# EAGLE design Nixie74141 (EAGLE 5.10)
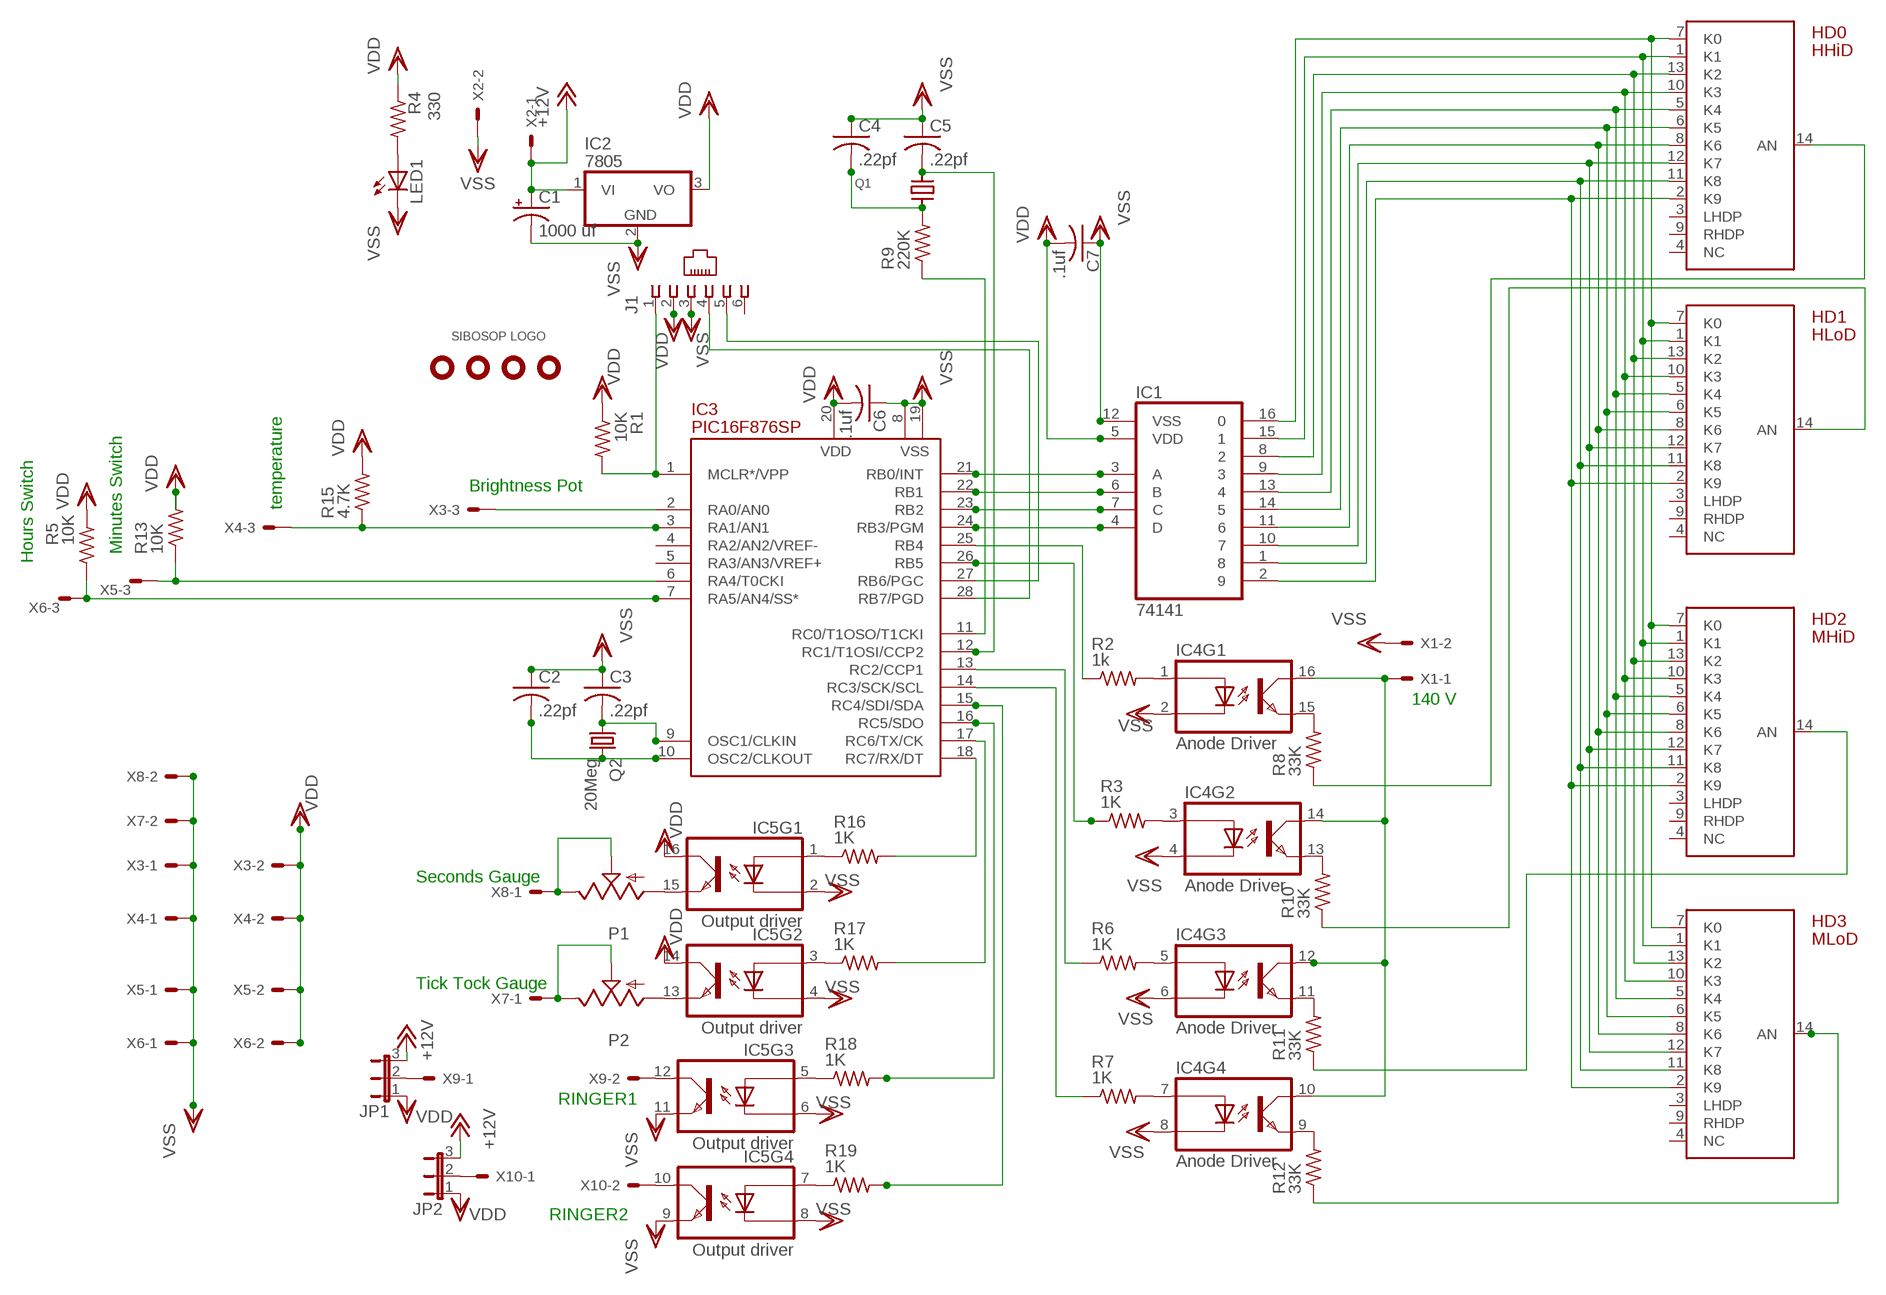
[diagram p0: schematic, sheet 1]

## Parts
C1  1000 uf  CPOL-USE3.5-10  [E3,5-10]
C2  .22pf  C-US025-024X044  [C025-024X044]
C3  .22pf  C-US025-024X044  [C025-024X044]
C4  .22pf  C-US025-024X044  [C025-024X044]
C5  .22pf  C-US025-024X044  [C025-024X044]
C6  .1uf  C-US025-024X044  [C025-024X044]
C7  .1uf  C-US025-024X044  [C025-024X044]
HD0  HHiD  NIXIE-5440-HEADER  [DIL14]
HD1  HLoD  NIXIE-5440-HEADER  [DIL14]
HD2  MHiD  NIXIE-5440-HEADER  [DIL14]
HD3  MLoD  NIXIE-5440-HEADER  [DIL14]
IC1  74141  [DIP16]
IC2  7805  [TO220V]
IC3  PIC16F876SP  [DIL28-3]
IC4  Anode Driver  TLP627  [DIP16]
IC5  Output driver  TLP627  [DIP16]
J1  520250-3  [520250-3]
JP1  JP2E  [JP2]
JP2  JP2E  [JP2]
LED1  LEDSQR2X5  [LED2X5]
P1  TRIMPOT  [RJ6S]
P2  TRIMPOT  [RJ6S]
Q1  ECS-2X6  [RADIAL-CRYSTAL-2.1MM]
Q2  20Meg  CRYSTALHC49S  [HC49/S]
R1  10K  R-US_0204/2V  [0204V]
R2  1k  R-US_0204/2V  [0204V]
R3  1K  R-US_0204/2V  [0204V]
R4  330  R-US_0204/2V  [0204V]
R5  10K  R-US_0204/2V  [0204V]
R6  1K  R-US_0204/2V  [0204V]
R7  1K  R-US_0204/2V  [0204V]
R8  33K  R-US_0204/2V  [0204V]
R9  220K  R-US_0204/2V  [0204V]
R10  33K  R-US_0204/2V  [0204V]
R11  33K  R-US_0204/2V  [0204V]
R12  33K  R-US_0204/2V  [0204V]
R13  10K  R-US_0204/2V  [0204V]
R15  4.7K  R-US_0204/2V  [0204V]
R16  1K  R-US_0204/2V  [0204V]
R17  1K  R-US_0204/2V  [0204V]
R18  1K  R-US_0204/2V  [0204V]
R19  1K  R-US_0204/2V  [0204V]
U$1  HOLE-125  [HOLE-125]
U$2  HOLE-125  [HOLE-125]
U$3  LOGO  [LOGO]
U$5  HOLE-125  [HOLE-125]
U$7  HOLE-125  [HOLE-125]
X1  22-23-2021  [22-23-2021]
X2  22-23-2021  [22-23-2021]
X3  22-23-2031  [22-23-2031]
X4  22-23-2031  [22-23-2031]
X5  22-23-2031  [22-23-2031]
X6  22-23-2031  [22-23-2031]
X7  22-23-2021  [22-23-2021]
X8  22-23-2021  [22-23-2021]
X9  22-23-2021  [22-23-2021]
X10  22-23-2021  [22-23-2021]

## Nets
+12V: C1.+ IC2.1(VI) JP1.3 JP2.3 X2.1
N$1: IC3.28(RB7/PGD) J1.4
N$2: IC3.6(RA4/T0CKI) R13.1 X5.3
N$3: C2.2 IC3.10(OSC2/CLKOUT) Q2.2
N$4: C3.2 IC3.9(OSC1/CLKIN) Q2.1
N$5: IC3.27(RB6/PGC) J1.5
N$6: IC3.1(MCLR*/VPP) J1.1 R1.2
N$7: HD0.7(K0) HD1.7(K0) HD2.7(K0) HD3.7(K0) IC1.16
N$8: HD0.1(K1) HD1.1(K1) HD2.1(K1) HD3.1(K1) IC1.15
N$9: HD0.13(K2) HD1.13(K2) HD2.13(K2) HD3.13(K2) IC1.8
N$10: HD0.10(K3) HD1.10(K3) HD2.10(K3) HD3.10(K3) IC1.9
N$11: HD0.5(K4) HD1.5(K4) HD2.5(K4) HD3.5(K4) IC1.13
N$12: IC1.3(A) IC3.21(RB0/INT)
N$13: HD0.8(K6) HD1.8(K6) HD2.8(K6) HD3.8(K6) IC1.11
N$14: HD0.12(K7) HD1.12(K7) HD2.12(K7) HD3.12(K7) IC1.10
N$15: HD0.11(K8) HD1.11(K8) HD2.11(K8) HD3.11(K8) IC1.1
N$16: HD0.2(K9) HD1.2(K9) HD2.2(K9) HD3.2(K9) IC1.2
N$17: IC1.6(B) IC3.22(RB1)
N$18: IC1.7(C) IC3.23(RB2)
N$19: IC1.4(D) IC3.24(RB3/PGM)
N$20: IC3.11(RC0/T1OSO/T1CKI) R9.1
N$21: HD0.6(K5) HD1.6(K5) HD2.6(K5) HD3.6(K5) IC1.14
N$22: LED1.A R4.2
N$23: C5.2 IC3.12(RC1/T1OSI/CCP2) Q1.1
N$24: IC4.1(AN) R2.2
N$25: IC4.5(AN) R6.2
N$26: IC4.7(AN) R7.2
N$27: IC3.25(RB4) R2.1
N$28: IC3.26(RB5) R3.1
N$29: IC3.13(RC2/CCP1) R6.1
N$30: IC3.14(RC3/SCK/SCL) R7.1
N$31: C4.2 Q1.2 R9.2
N$32: IC3.7(RA5/AN4/SS*) R5.1 X6.3
N$33: IC4.3(AN) R3.2
N$34: P2.E P2.S X7.1
N$35: IC4.15(EM) R8.2
N$36: IC4.13(EM) R10.2
N$37: IC4.11(EM) R11.2
N$38: IC4.9(EM) R12.2
N$39: HD0.14(AN) R8.1
N$40: HD1.14(AN) R10.1
N$41: HD2.14(AN) R11.1
N$42: HD3.14(AN) R12.1
N$43: IC3.2(RA0/AN0) X3.3
N$44: IC5.15(EM) P1.A
N$45: IC5.13(EM) P2.A
N$46: IC3.3(RA1/AN1) R15.1 X4.3
N$47: IC5.1(AN) R16.1
N$48: IC5.3(AN) R17.1
N$49: IC5.5(AN) R18.1
N$50: IC5.7(AN) R19.1
N$51: P1.E P1.S X8.1
N$53: JP1.2 X9.1
N$54: IC5.12(CO) X9.2
N$55: JP2.2 X10.1
N$56: IC5.10(CO) X10.2
N$57: IC3.18(RC7/RX/DT) R16.2
N$58: IC3.17(RC6/TX/CK) R17.2
N$59: IC3.16(RC5/SDO) R18.2
N$60: IC3.15(RC4/SDI/SDA) R19.2
N$61: IC4.10(CO) IC4.12(CO) IC4.14(CO) IC4.16(CO) X1.1
VDD: C6.2 C7.2 IC1.5(VDD) IC2.3(VO) IC3.20(VDD) IC5.14(CO) IC5.16(CO) J1.2 JP1.1 JP2.1 R1.1 R4.1 R5.2 R13.2 R15.2 X3.2 X4.2 X5.2 X6.2
VSS: C1.- C2.1 C3.1 C4.1 C5.1 C6.1 C7.1 IC1.12(VSS) IC2.2(GND) IC3.8(VSS) IC3.19(VSS) IC4.2(CA) IC4.4(CA) IC4.6(CA) IC4.8(CA) IC5.2(CA) IC5.4(CA) IC5.6(CA) IC5.8(CA) IC5.9(EM) IC5.11(EM) J1.3 LED1.K(C) X1.2 X2.2 X3.1 X4.1 X5.1 X6.1 X7.2 X8.2
Unconnected: HD0.3(LHDP) HD0.4(NC) HD0.9(RHDP) HD1.3(LHDP) HD1.4(NC) HD1.9(RHDP) HD2.3(LHDP) HD2.4(NC) HD2.9(RHDP) HD3.3(LHDP) HD3.4(NC) HD3.9(RHDP) IC3.4(RA2/AN2/VREF-) IC3.5(RA3/AN3/VREF+) J1.6

## Notes on the sheet
- Brightness Pot
- temperature
- Minutes Switch
- Hours Switch
- 140 V
- Seconds Gauge
- Tick Tock Gauge
- RINGER1
- RINGER2

## Library data of the parts
C1 = rcl:CPOL-US: POLARIZED CAPACITOR, American symbol
C2-C7 = rcl:C-US: CAPACITOR, American symbol
HD0 HD1-HD3 = sibosop:NIXIE-5440-HEADER: 14 pin dip header used to interface with a Nixie 5440 type tube
IC1 = sibosop:74141: Nixie BCD Decoder
IC2 = kmarx1:78*: 78xx Family - Positive voltage regulator
IC3 = pic16f87x:PIC16F876: FLASH MICROCONTROLLER
IC4 IC5 = sibosop:TLP627: Toshiba 4 unit photocoupler
J1 = con-amp:520250-3: AMP connector
JP1 JP2 = jumper:JP2E: JUMPER
LED1 = led:LED: LED OSRAM: - CHIPLED LG R971, LG N971, LY N971, LG Q971, LY Q971, LO R971, LY R971 LH N974, LH R974 LS Q976, LO Q976, LY Q976 LO Q996 - Hyper CHIPLED LW Q18S LB Q993, LB Q99A, LB R99A - SideLED LS A670, LO A670, LY A670, LG A670, LP A670 LB A673, LV A673, LT A673, LW A673 LH A674 LY A675 LS A676, LA A676, LO A676, LY A676, LW A676 LS A679, LY A679, LG A679 - Hyper Micro SIDELED® LS Y876, LA Y876, LO Y876, LY Y876 LT Y87S - SmartLED LW L88C, LW L88S LB L89C, LB L89S, LG L890 LS L89K, LO L89K, LY L89K LS L896, LA L896, LO L896, LY L896 - TOPLED LS T670, LO T670, LY T670, LG T670, LP T670 LSG T670, LSP T670, LSY T670, LOP T670, LYG T670 LG T671, LOG T671, LSG T671 LB T673, LV T673, LT T673, LW T673 LH T674 LS T676, LA T676, LO T676, LY T676, LB T676, LH T676, LSB T676, LW T676 LB T67C, LV T67C, LT T67C, LS T67K, LO T67K, LY T67K, LW E67C LS E67B, LA E67B, LO E67B, LY E67B, LB E67C, LV E67C, LT E67C LW T67C LS T679, LY T679, LG T679 LS T770, LO T770, LY T770, LG T770, LP T770 LB T773, LV T773, LT T773, LW T773 LH T774 LS E675, LA E675, LY E675, LS T675 LS T776, LA T776, LO T776, LY T776, LB T776 LHGB T686 LT T68C, LB T68C - Hyper Mini TOPLED® LB M676 - Mini TOPLED Santana® LG M470 LS M47K, LO M47K, LY M47K Source: http://www.osram.convergy.de LUXEON: - LUMILED® LXK2-PW12-R00, LXK2-PW12-S00, LXK2-PW14-U00, LXK2-PW14-V00 LXK2-PM12-R00, LXK2-PM12-S00, LXK2-PM14-U00 LXK2-PE12-Q00, LXK2-PE12-R00, LXK2-PE12-S00, LXK2-PE14-T00, LXK2-PE14-U00 LXK2-PB12-K00, LXK2-PB12-L00, LXK2-PB12-M00, LXK2-PB14-N00, LXK2-PB14-P00, LXK2-PB14-Q00 LXK2-PR12-L00, LXK2-PR12-M00, LXK2-PR14-Q00, LXK2-PR14-R00 LXK2-PD12-Q00, LXK2-PD12-R00, LXK2-PD12-S00 LXK2-PH12-R00, LXK2-PH12-S00 LXK2-PL12-P00, LXK2-PL12-Q00, LXK2-PL12-R00 Source: www.luxeon.com KINGBRIGHT: KA-3528ASYC Source: www.kingbright.com
P1 P2 = sibosop:TRIMPOT
Q1 = kmarx1:ECS-2X6: ECS 2x6 32khz Tuning Fork Crystal ECS-.327-12.5-13 digikey X802-ND
Q2 = crystal:CRYSTAL: CRYSTAL
R1-R13 R15-R19 = rcl:R-US_: RESISTOR, American symbol
U$1 U$2 U$5 U$7 = sibosop:HOLE-125
U$3 = sibosop:LOGO
X1 X2 X7-X10 = sibosop-con-molex:22-23-2021: .100" (2.54mm) Center Header - 2 Pin
X3-X6 = sibosop-con-molex:22-23-2031: .100" (2.54mm) Center Header - 3 Pin

## Board
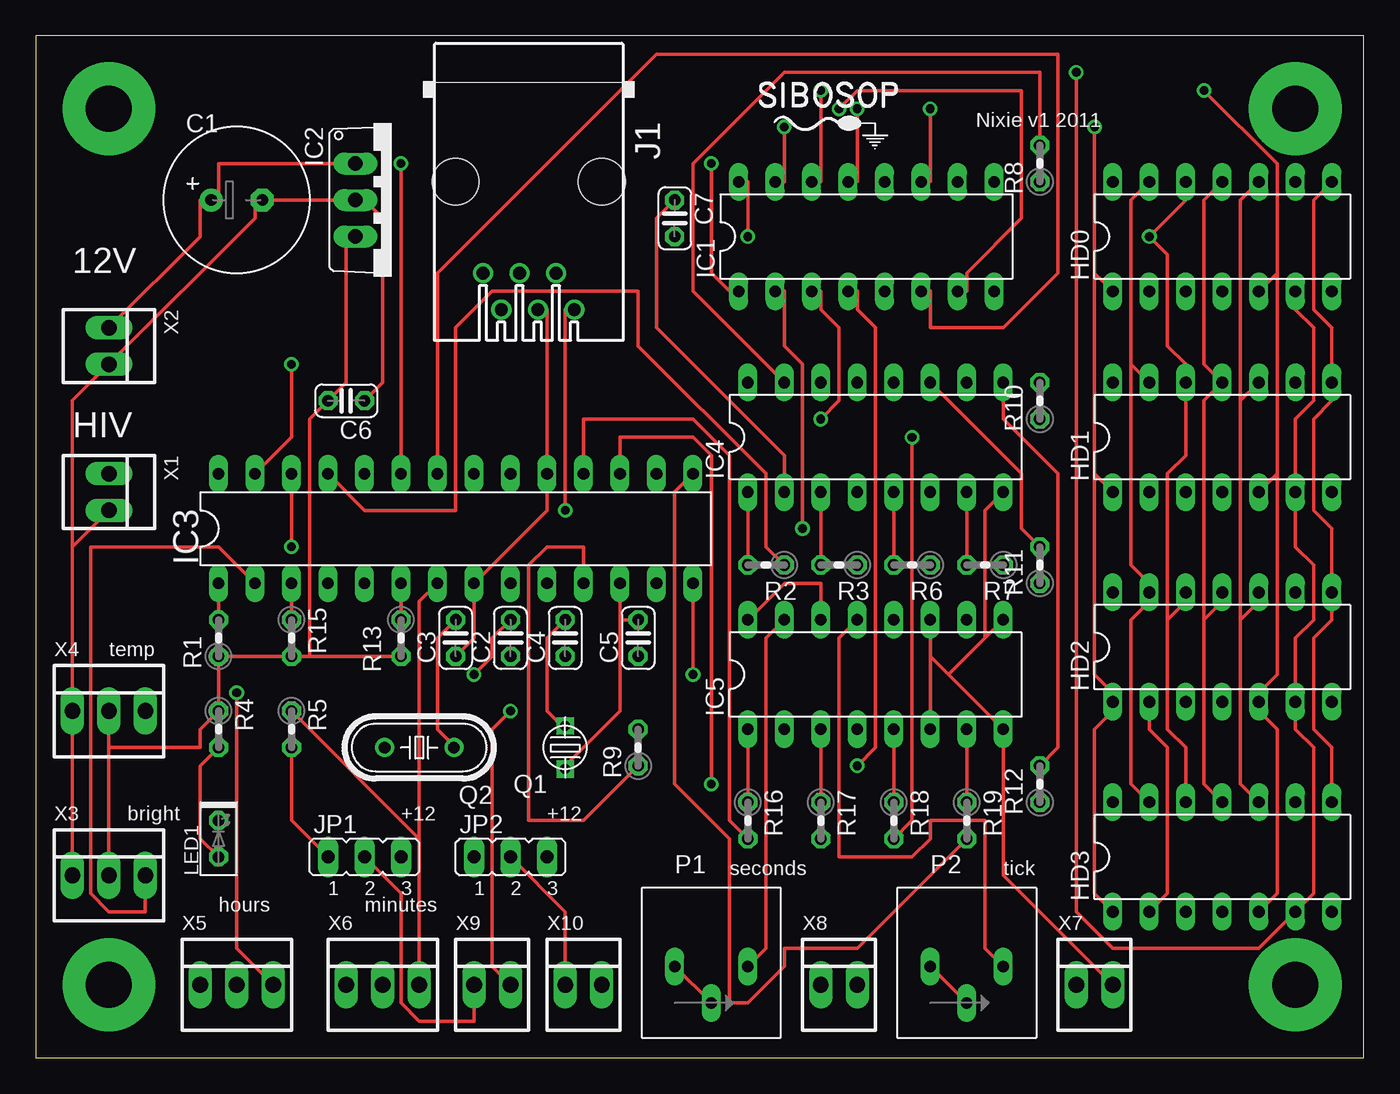
[diagram p1: board, top side]
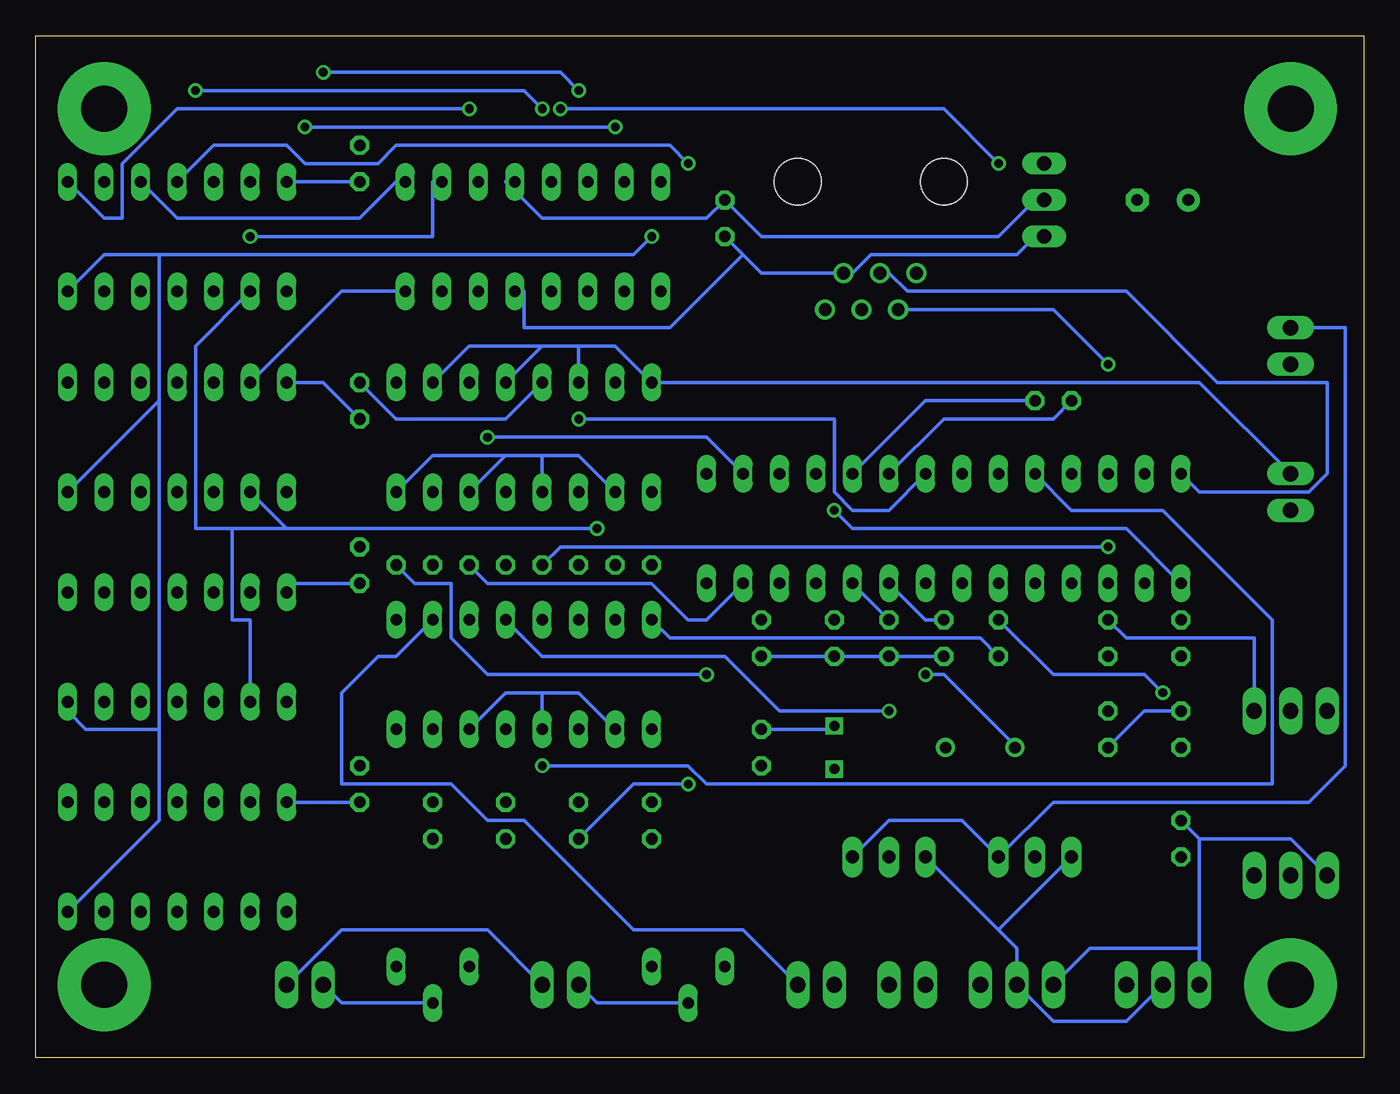
[diagram p2: board, bottom side, seen from below]

Size 92.38 x 71.11 mm. Coordinates in mm from the lower left corner, seen from the top.
Outline: 0,0 92.38,0 92.38,71.11 0,71.11 0,0
Copper layers (1*16): Top 0.035mm / dielectric 1.5mm / Bottom 0.035mm
Design rules "default": minimum track width 10mil, minimum drill 24mil, track to track 8mil, track to pad 8mil, pad to pad 8mil, via to via 8mil, smd to smd 8mil, copper to edge 40mil, drill to drill 8mil, minimum pad ring 10mil, minimum via ring 8mil, stop-mask expansion 4mil, vias tented up to drill 0mil, thermal gap 10mil

### Footprints (pad centres in the part's own frame; a part is rotated, then mirrored left to right if it is on the bottom)
E3,5-10 = drill 0.813 pad 1.6 round: + -1.778,0 | drill 0.813 pad 1.6 octagon: - 1.778,0
C025-024X044 = drill 0.813 octagon: 1 -1.27,0; 2 1.27,0
DIL14 = drill 0.813 long: 1 -7.62,-3.81; 2 -5.08,-3.81; 3 -2.54,-3.81; 4 0,-3.81; 5 2.54,-3.81; 6 5.08,-3.81; 7 7.62,-3.81; 8 7.62,3.81; 9 5.08,3.81; 10 2.54,3.81; 11 0,3.81; 12 -2.54,3.81; 13 -5.08,3.81; 14 -7.62,3.81
DIP16 = drill 0.813 long: 1 -8.89,-3.81; 2 -6.35,-3.81; 3 -3.81,-3.81; 4 -1.27,-3.81; 5 1.27,-3.81; 6 3.81,-3.81; 7 6.35,-3.81; 8 8.89,-3.81; 9 8.89,3.81; 10 6.35,3.81; 11 3.81,3.81; 12 1.27,3.81; 13 -1.27,3.81; 14 -3.81,3.81; 15 -6.35,3.81; 16 -8.89,3.81
TO220V = drill 1.016 long: 1 -2.54,0; 2 0,0; 3 2.54,0
DIL28-3 = drill 0.813 long: 1 -16.51,-3.81; 2 -13.97,-3.81; 3 -11.43,-3.81; 4 -8.89,-3.81; 5 -6.35,-3.81; 6 -3.81,-3.81; 7 -1.27,-3.81; 8 1.27,-3.81; 9 3.81,-3.81; 10 6.35,-3.81; 11 8.89,-3.81; 12 11.43,-3.81; 13 13.97,-3.81; 14 16.51,-3.81; 15 16.51,3.81; 16 13.97,3.81; 17 11.43,3.81; 18 8.89,3.81; 19 6.35,3.81; 20 3.81,3.81; 21 1.27,3.81; 22 -1.27,3.81; 23 -3.81,3.81; 24 -6.35,3.81; 25 -8.89,3.81; 26 -11.43,3.81; 27 -13.97,3.81; 28 -16.51,3.81
520250-3 = drill 0.889 round: 1 -3.175,8.89; 2 -1.905,6.35; 3 -0.635,8.89; 4 0.635,6.35; 5 1.905,8.89; 6 3.175,6.35 | hole 3.251: -5.08,0; 5.08,0
JP2 = drill 0.914 long: 1 -2.54,0; 2 0,0; 3 2.54,0
LED2X5 = drill 0.813 octagon: A -1.27,0; K 1.27,0
RJ6S = drill 0.813 long: A 2.54,0; E -2.54,0; S 0,-2.54
RADIAL-CRYSTAL-2.1MM = drill 0.7 square: 1 0,1.5; 2 0,-1.5
HC49/S = drill 0.813 round: 1 -2.413,0; 2 2.413,0
0204V = drill 0.813 octagon: 1 -1.27,0; 2 1.27,0
HOLE-125 = drill 3.2 pad 6.452 round: P$1 0,0
22-23-2021 = drill 1.1 long: 1 -1.27,0; 2 1.27,0
22-23-2031 = drill 1.1 long: 1 -2.54,0; 2 0,0; 3 2.54,0

### Placement (x,y rotation side)
C1  13.97,59.69 0 top
C2  33.02,29.21 90 top
C3  29.21,29.21 90 top
C4  36.83,29.21 90 top
C5  41.91,29.21 90 top
C6  21.59,45.72 180 top
C7  44.45,58.42 270 top
HD0  82.55,57.15 0 top
HD1  82.55,43.18 0 top
HD2  82.55,28.57 0 top
HD3  82.55,13.97 0 top
IC1  57.78,57.15 0 top
IC2  22.23,59.69 270 top
IC3  29.21,36.83 0 top
IC4  58.42,43.18 0 top
IC5  58.42,26.67 0 top
J1  34.29,60.96 180 top
JP1  22.86,13.97 0 top
JP2  33.02,13.97 0 top
LED1  12.7,15.24 90 top
P1  46.99,6.35 0 top
P2  64.77,6.35 0 top
Q1  36.83,21.59 180 top
Q2  26.67,21.59 180 top
R1  12.7,29.21 90 top
R2  50.8,34.29 180 top
R3  55.88,34.29 180 top
R4  12.7,22.86 270 top
R5  17.78,22.86 270 top
R6  60.96,34.29 180 top
R7  66.04,34.29 180 top
R8  69.85,62.23 90 top
R9  41.91,21.59 90 top
R10  69.85,45.72 90 top
R11  69.85,34.29 90 top
R12  69.85,19.05 90 top
R13  25.4,29.21 270 top
R15  17.78,29.21 270 top
R16  49.53,16.51 270 top
R17  54.61,16.51 270 top
R18  59.69,16.51 270 top
R19  64.77,16.51 270 top
U$1  5.08,66.04 0 top
U$2  5.08,5.08 0 top
U$3  54.61,66.67 0 top
U$5  87.63,5.08 0 top
U$7  87.63,66.04 0 top
X1  5.08,39.37 270 top
X2  5.08,49.53 270 top
X3  5.08,12.7 0 top
X4  5.08,24.13 0 top
X5  13.97,5.08 0 top
X6  24.13,5.08 0 top
X7  73.66,5.08 0 top
X8  55.88,5.08 0 top
X9  31.75,5.08 0 top
X10  38.1,5.08 0 top

### Tracks (layer width: path | path; a pad name or v marks a point on that pad's centre or on a via)
+12V
  Top 0.254: IC2.1 12.7,62.23 12.7,59.69 C1.+ 11.43,59.69 11.43,57.15 X2.1
  Bottom 0.254: JP2.3 33.02,16.51 27.94,16.51 JP1.3 21.59,17.78 3.81,17.78 1.27,20.32 1.27,50.8 X2.1
N$1
  Bottom 0.254: IC3.28 11.43,39.37 3.81,39.37 2.54,40.64 2.54,46.99 10.16,46.99 16.51,53.34 31.75,53.34 33.02,54.61 J1.4
N$2  (via drill 0.61)
  Top 0.254: R13.1 IC3.6 | X5.3 13.97,7.62 v13.97,25.4
  Bottom 0.254: v13.97,25.4 15.24,26.67 21.59,26.67 R13.1
N$3  (via drill 0.61)
  Top 0.254: v30.48,26.67 31.75,27.94 31.75,29.21 C2.2
  Bottom 0.254: v30.48,26.67 29.21,26.67 24.13,21.59 Q2.2 | C2.2 IC3.10
N$4
  Top 0.254: C3.2 27.94,29.21 27.94,22.86 29.21,21.59 Q2.1
  Bottom 0.254: IC3.9 30.48,30.48 C3.2
N$5  (via drill 0.61)
  Top 0.254: IC3.27 17.78,43.18 v17.78,48.26
  Bottom 0.254: v17.78,48.26 21.59,52.07 J1.5
N$6  (via drill 0.61)
  Top 0.254: R1.2 IC3.1 | v36.83,38.1 36.83,52.07 J1.1
  Bottom 0.254: v36.83,38.1 35.56,36.83 16.51,36.83 IC3.1
N$7  (via drill 0.61)
  Top 0.254: v49.53,57.15 49.53,60.96 IC1.16
  Bottom 0.254: HD3.7 83.82,16.51 83.82,22.86 | 83.82,22.86 88.9,22.86 90.17,24.13 HD2.7 | v49.53,57.15 50.8,55.88 83.82,55.88 | 83.82,55.88 87.63,55.88 HD0.7 | 83.82,45.72 HD1.7 | 83.82,45.72 83.82,55.88 | 83.82,22.86 83.82,45.72
N$8  (via drill 0.61)
  Top 0.254: HD3.1 73.66,11.43 73.66,22.86 74.93,24.13 HD2.1 74.93,25.4 73.66,26.67 73.66,40.64 | v52.07,64.77 52.07,60.96 IC1.15 | 73.66,54.61 v73.66,64.77 | 73.66,54.61 HD0.1 | 73.66,40.64 HD1.1 | 73.66,40.64 73.66,54.61
  Bottom 0.254: v73.66,64.77 v52.07,64.77
N$9
  Top 0.254: HD3.13 76.2,19.05 76.2,30.48 77.47,31.75 HD2.13 77.47,33.02 76.2,34.29 76.2,48.26 | HD0.13 76.2,59.69 76.2,48.26 | 76.2,48.26 HD1.13
  Bottom 0.254: HD1.13 71.12,53.34 IC1.8
N$10
  Top 0.254: HD3.10 83.82,19.05 83.82,30.48 | 83.82,30.48 85.09,31.75 HD2.10 | 83.82,45.72 HD1.10 | 83.82,30.48 83.82,45.72 | HD0.10 83.82,59.69 83.82,45.72
  Bottom 0.254: HD0.10 82.55,58.42 69.85,58.42 67.31,60.96 IC1.9
N$11  (via drill 0.61)
  Top 0.254: HD3.5 86.36,11.43 86.36,22.86 85.09,24.13 HD2.5 85.09,25.4 86.36,26.67 86.36,40.64 | v57.15,66.04 57.15,60.96 IC1.13 | v81.28,67.31 86.36,62.23 86.36,54.61 | 86.36,54.61 HD0.5 | 86.36,40.64 HD1.5 | 86.36,40.64 86.36,54.61
  Bottom 0.254: v57.15,66.04 58.42,67.31 v81.28,67.31
N$12  (via drill 0.61)
  Top 0.254: v54.61,44.45 55.88,45.72 55.88,50.8 54.61,52.07 54.61,53.34 IC1.3
  Bottom 0.254: IC3.21 33.02,38.1 35.56,38.1 36.83,39.37 36.83,44.45 v54.61,44.45
N$13  (via drill 0.61)
  Top 0.254: HD3.8 90.17,21.59 88.9,22.86 88.9,29.21 90.17,30.48 HD2.8 90.17,36.83 88.9,38.1 88.9,44.45 90.17,45.72 HD1.8 90.17,50.8 88.9,52.07 88.9,59.69 HD0.8 | v62.23,66.04 62.23,60.96 IC1.11
  Bottom 0.254: v62.23,66.04 82.55,66.04 86.36,62.23 86.36,58.42 87.63,58.42 HD0.8
N$14  (via drill 0.61)
  Top 0.254: HD0.12 80.01,59.69 v77.47,57.15 78.74,55.88 78.74,49.53 80.01,48.26 HD1.12 80.01,41.91 78.74,40.64 78.74,30.48 | HD3.12 80.01,21.59 78.74,22.86 78.74,30.48 | 78.74,30.48 80.01,31.75 HD2.12
  Bottom 0.254: v77.47,57.15 64.77,57.15 64.77,60.96 IC1.10
N$15  (via drill 0.61)
  Top 0.254: HD3.11 81.28,19.05 81.28,30.48 | 81.28,30.48 82.55,31.75 HD2.11 | 81.28,30.48 81.28,45.72 HD1.11 81.28,48.26 81.28,59.69 HD0.11 | v46.99,62.23 46.99,54.61 48.26,53.34 IC1.1
  Bottom 0.254: v46.99,62.23 48.26,63.5 67.31,63.5 68.58,62.23 73.66,62.23 74.93,63.5 80.01,63.5 HD0.11
N$16  (via drill 0.61)
  Top 0.254: HD3.2 78.74,11.43 78.74,21.59 77.47,22.86 HD2.2 | v53.34,36.83 53.34,48.26 52.07,49.53 52.07,53.34 IC1.2
  Bottom 0.254: 74.93,36.83 v53.34,36.83 | 74.93,36.83 HD1.2 | HD0.2 81.28,49.53 81.28,36.83 78.74,36.83 | 78.74,36.83 74.93,36.83 | 78.74,36.83 78.74,30.48 77.47,30.48 HD2.2
N$17
  Top 0.254: IC3.22 27.94,54.61 43.18,69.85 71.12,69.85 71.12,54.61 67.31,50.8 62.23,50.8 62.23,53.34 IC1.6
N$18  (via drill 0.61)
  Top 0.254: IC3.23 v25.4,62.23 | v55.88,66.04 57.15,67.31 68.58,67.31 68.58,58.42 64.77,54.61 64.77,53.34 IC1.7
  Bottom 0.254: v25.4,62.23 29.21,66.04 v55.88,66.04
N$19  (via drill 0.61)
  Top 0.254: v57.15,20.32 58.42,21.59 58.42,50.8 57.15,52.07 57.15,53.34 IC1.4
  Bottom 0.254: IC3.24 20.32,38.1 13.97,38.1 6.35,30.48 6.35,19.05 45.72,19.05 46.99,20.32 v57.15,20.32
N$20
  Top 0.254: R9.1 38.1,16.51 34.29,16.51 34.29,34.29 35.56,35.56 38.1,35.56 IC3.11
N$21  (via drill 0.61)
  Top 0.254: HD0.6 87.63,52.07 88.9,50.8 88.9,45.72 87.63,44.45 HD1.6 87.63,35.56 88.9,34.29 88.9,30.48 87.63,29.21 HD2.6 87.63,22.86 88.9,21.59 88.9,11.43 HD3.6 85.09,7.62 74.93,7.62 72.39,10.16 v72.39,68.58 | v54.61,67.31 54.61,60.96 IC1.14
  Bottom 0.254: v54.61,67.31 55.88,68.58 v72.39,68.58
N$22
  Top 0.254: LED1.A 11.43,15.24 11.43,20.32 R4.2
N$23
  Top 0.254: 40.64,30.48 IC3.12 | 40.64,30.48 40.64,24.13 36.83,20.32 Q1.1 | 40.64,30.48 C5.2
N$24
  Top 0.254: R2.2 IC4.1
N$25
  Top 0.254: R6.2 IC4.5
N$26
  Top 0.254: R7.2 IC4.7
N$27
  Top 0.254: IC3.25 22.86,38.1 29.21,38.1 29.21,50.8 31.75,53.34 41.91,53.34 41.91,49.53 50.8,40.64 50.8,35.56 R2.1
N$28  (via drill 0.61)
  Top 0.254: v17.78,35.56 IC3.26
  Bottom 0.254: v17.78,35.56 55.88,35.56 R3.1
N$29
  Bottom 0.254: IC3.13 45.72,30.48 46.99,30.48 49.53,33.02 60.96,33.02 R6.1
N$30  (via drill 0.61)
  Top 0.254: v45.72,26.67 IC3.14
  Bottom 0.254: v45.72,26.67 60.96,26.67 63.5,29.21 63.5,33.02 66.04,33.02 R7.1
N$31
  Top 0.254: C4.2 35.56,29.21 35.56,24.13 36.83,22.86 Q1.2
  Bottom 0.254: R9.2 36.83,22.86 Q1.2
N$32
  Top 0.254: 26.67,15.24 R5.1 | X6.3 26.67,15.24 | IC3.7 26.67,31.75 26.67,15.24
N$33
  Top 0.254: R3.2 IC4.3
N$34
  Top 0.254: P2.S P2.E
  Bottom 0.254: X7.1 71.12,3.81 P2.S
N$35
  Top 0.254: IC4.15 45.72,53.34 45.72,62.23 52.07,68.58 69.85,68.58 R8.2
N$36
  Bottom 0.254: IC4.13 59.69,44.45 67.31,44.45 R10.2
N$37
  Top 0.254: R11.2 68.58,36.83 68.58,40.64 IC4.11
N$38
  Top 0.254: R12.2 71.12,21.59 71.12,40.64 67.31,44.45 IC4.9
N$39
  Bottom 0.254: R8.1 HD0.14
N$40
  Bottom 0.254: R10.1 72.39,46.99 HD1.14
N$41
  Bottom 0.254: R11.1 74.93,33.02 HD2.14
N$42
  Bottom 0.254: R12.1 HD3.14
N$43
  Top 0.254: IC3.2 12.7,35.56 3.81,35.56 3.81,11.43 5.08,10.16 7.62,10.16 X3.3
N$44
  Top 0.254: P1.A 50.8,7.62 50.8,29.21 IC5.15
N$45
  Top 0.254: P2.A 66.04,7.62 66.04,16.51 62.23,16.51 62.23,15.24 60.96,13.97 55.88,13.97 55.88,29.21 IC5.13
N$46
  Top 0.254: R15.1 IC3.3
  Bottom 0.254: X4.3 7.62,29.21 16.51,29.21 R15.1
N$47
  Top 0.254: R16.1 IC5.1
N$48
  Top 0.254: R17.1 IC5.3
N$49
  Top 0.254: R18.1 IC5.5
N$50
  Top 0.254: R19.1 IC5.7
N$51
  Top 0.254: P1.S P1.E
  Bottom 0.254: X8.1 53.34,3.81 P1.S
N$53
  Top 0.254: JP1.2 25.4,11.43 25.4,3.81 26.67,2.54 30.48,2.54 X9.1
N$54  (via drill 0.61)
  Top 0.254: v33.02,24.13 31.75,22.86 31.75,6.35 X9.2
  Bottom 0.254: IC5.12 57.15,27.94 44.45,27.94 40.64,24.13 v33.02,24.13
N$55
  Top 0.254: JP2.2 36.83,10.16 X10.1
N$56
  Bottom 0.254: IC5.10 67.31,27.94 68.58,27.94 71.12,25.4 71.12,19.05 63.5,19.05 60.96,16.51 58.42,16.51 50.8,8.89 43.18,8.89 X10.2
N$57
  Top 0.254: R16.2 48.26,16.51 48.26,41.91 45.72,44.45 38.1,44.45 IC3.18
N$58  (via drill 0.61)
  Top 0.254: v46.99,19.05 46.99,41.91 45.72,43.18 40.64,43.18 IC3.17
  Bottom 0.254: R17.2 50.8,19.05 v46.99,19.05
N$59  (via drill 0.61)
  Top 0.254: R18.2 60.96,16.51 v60.96,43.18
  Bottom 0.254: v60.96,43.18 45.72,43.18 IC3.16
N$60
  Top 0.254: R19.2 57.15,7.62 52.07,7.62 52.07,6.35 49.53,3.81 48.26,3.81 48.26,15.24 44.45,19.05 44.45,39.37 IC3.15
N$61
  Bottom 0.254: 54.61,49.53 57.15,49.53 | 54.61,49.53 52.07,49.53 IC4.16 11.43,46.99 X1.1 | 57.15,49.53 IC4.12 | 54.61,49.53 IC4.14 | IC4.10 62.23,49.53 57.15,49.53
VDD
  Top 0.254: IC2.3 21.59,57.15 21.59,46.99 C6.2 19.05,44.45 19.05,27.94 | 5.08,21.59 X4.2 | 5.08,21.59 X3.2 | IC5.16 52.07,33.02 54.61,33.02 IC5.14 | 19.05,27.94 R15.2 R1.1 R4.1 11.43,22.86 11.43,21.59 5.08,21.59 | 19.05,27.94 R13.2 | JP1.1 17.78,16.51 R5.2
  Bottom 0.254: 43.18,55.88 41.91,54.61 J1.2 35.56,54.61 34.29,55.88 24.13,55.88 22.86,57.15 IC2.3 | 43.18,55.88 C7.2 | 43.18,55.88 48.26,50.8 58.42,50.8 58.42,53.34 IC1.5 | IC3.20 29.21,44.45 21.59,44.45 C6.2 | 25.4,8.89 24.13,7.62 X6.2 21.59,2.54 16.51,2.54 X5.2 | 25.4,8.89 JP2.1 | R5.2 15.24,24.13 R4.1 | IC5.16 48.26,29.21 26.67,29.21 R13.2 | 25.4,8.89 JP1.1
VSS
  Top 0.254: X3.1 X4.1 2.54,35.56 | 2.54,35.56 X1.2 | 2.54,35.56 2.54,45.72 X2.2 15.24,58.42 15.24,59.69 C1.- IC2.2 22.86,59.69 24.13,58.42 24.13,46.99 C6.1 | 62.23,27.94 IC5.6 | 62.23,27.94 IC5.11 | 63.5,26.67 62.23,27.94 | 63.5,26.67 IC5.8 67.31,12.7 X7.2 | 66.04,29.21 63.5,26.67 | 66.04,29.21 IC5.9 | IC4.8 66.04,38.1 66.04,29.21 | J1.3 35.56,52.07 IC3.19 35.56,38.1 IC3.8 30.48,29.21 C3.1 | IC4.2 52.07,41.91 43.18,50.8 43.18,58.42 C7.1
  Bottom 0.254: 11.43,15.24 LED1.K | 11.43,15.24 5.08,15.24 X3.1 | 11.43,7.62 11.43,15.24 | X5.1 11.43,7.62 | X6.1 19.05,7.62 11.43,7.62 | X8.2 60.96,8.89 71.12,8.89 X7.2 | IC4.2 54.61,41.91 57.15,41.91 | 57.15,41.91 59.69,41.91 | 59.69,41.91 IC4.6 | 57.15,41.91 IC4.4 | IC4.8 64.77,41.91 59.69,41.91 | IC5.2 54.61,25.4 57.15,25.4 | 57.15,25.4 59.69,25.4 IC5.6 | 57.15,25.4 IC5.4 | C3.1 C2.1 C4.1 C5.1 | IC1.12 59.69,60.96 57.15,58.42 45.72,58.42 C7.1 41.91,57.15 25.4,57.15 22.86,59.69 IC2.2 | IC3.19 30.48,45.72 C6.1

### Text on the board
tNames: Nixie v1 2011 | 12V | HIV | temp | bright | +12 | +12 | seconds | tick | hours | minutes